# EAGLE design FieldsCore (EAGLE 9.6.2)
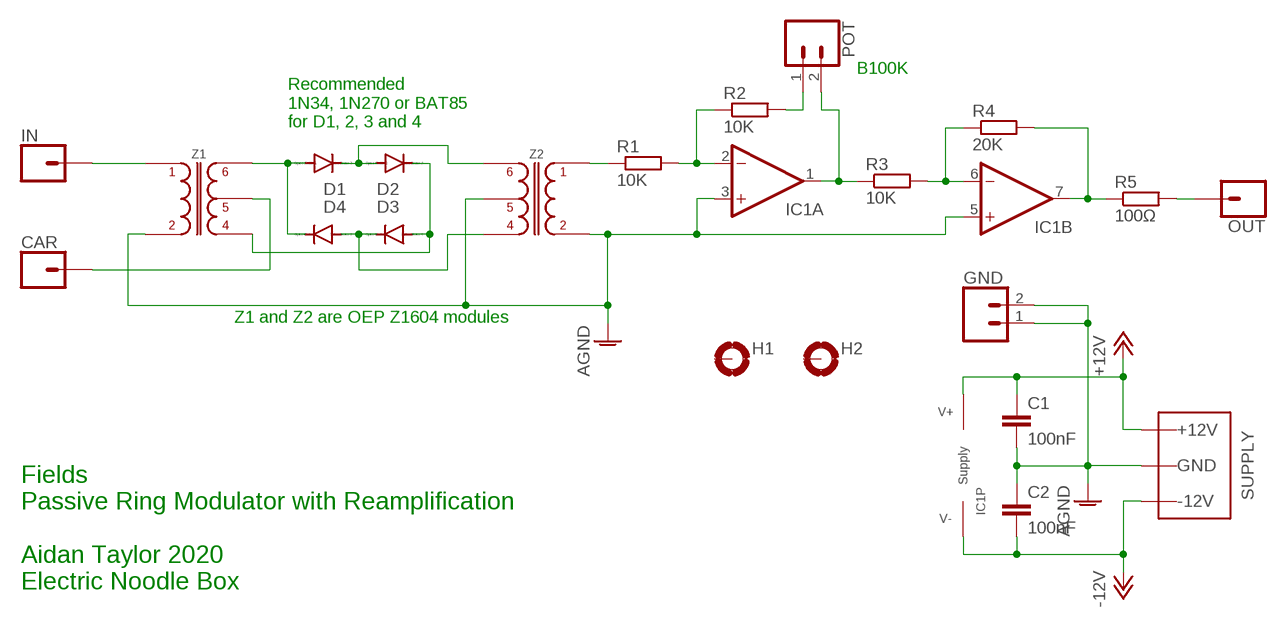
[diagram p0: schematic, sheet 1]

## Parts
C1  100nF  C-EU050-025X075  [C050-025X075]
C2  100nF  C-EU050-025X075  [C050-025X075]
CAR  1XWIREPAD  [1X01]
D1  DIODE-DO35-10  [DO35-10]
D2  DIODE-DO35-10  [DO35-10]
D3  DIODE-DO35-10  [DO35-10]
D4  DIODE-DO35-10  [DO35-10]
GND  2XWIREPAD  [1X02]
H1  MOUNT-PAD-ROUND3.2  [3,2-PAD]
H2  MOUNT-PAD-ROUND3.2  [3,2-PAD]
IC1  TL0X2DIL  [DIL08]
IN  1XWIREPAD  [1X01]
OUT  1XWIREPAD  [1X01]
POT  2XWIREPAD  [1X02]
R1  10K  R-EU_0207/10  [0207/10]
R2  10K  R-EU_0207/10  [0207/10]
R3  10K  R-EU_0207/10  [0207/10]
R4  20K  R-EU_0207/10  [0207/10]
R5  100Ω  R-EU_0207/10  [0207/10]
WP1  COMBO_SUPPLY_HEADER  [COMBINED_POWER]
Z1  Z1604_AUDIO_TRANSFORMER  [Z1604_TRANSFORMER]
Z2  Z1604_AUDIO_TRANSFORMER  [Z1604_TRANSFORMER]

## Nets
+12V: C1.1 IC1.8(P:V+) WP1.V+1(V++) WP1.V+2(V++) WP1.V+3(V++)
-12V: C2.2 IC1.4(P:V-) WP1.V-1(V--) WP1.V-2(V--) WP1.V-3(V--)
AGND: C1.2 C2.1 GND.1 GND.2 IC1.3(A:+IN) IC1.5(B:+IN) WP1.GND1(AGND) WP1.GND2(AGND) WP1.GND3(AGND) WP1.GND4(AGND) WP1.GND5(AGND) WP1.GND6(AGND) WP1.GND7(AGND) WP1.GND8(AGND) Z1.T3 Z2.T3 Z2.T5
N$1: D1.A D4.C Z1.T6
N$2: D1.C D2.A Z2.T6
N$3: D2.C D3.A Z1.T4
N$4: D3.C D4.A Z2.T4
N$5: CAR.1 Z1.T5
N$6: R1.1 Z2.T1
N$7: IC1.2(A:-IN) R1.2 R2.1
N$8: IN.1 Z1.T1
N$10: POT.1 R2.2
N$11: IC1.1(A:OUT) POT.2 R3.1
N$12: IC1.6(B:-IN) R3.2 R4.1
N$13: IC1.7(B:OUT) R4.2 R5.1
N$14: OUT.1 R5.2
Unconnected: H1.B3,2(MOUNT) H2.B3,2(MOUNT)

## Notes on the sheet
- B100K
- Recommended 
  1N34, 1N270 or BAT85
  for D1, 2, 3 and 4
- Z1 and Z2 are OEP Z1604 modules
- Fields 
  Passive Ring Modulator with Reamplification
  
  Aidan Taylor 2020
  Electric Noodle Box

## Library data of the parts
C1 C2 = rcl:C-EU: CAPACITOR, European symbol; SPICEPREFIX: C
CAR IN OUT = ElectricNoodleBox:1XWIREPAD
D1-D4 = diode:DIODE-: DIODE
GND POT = ElectricNoodleBox:2XWIREPAD
H1 H2 = holes:MOUNT-PAD-ROUND: MOUNTING PAD, round
IC1 = ElectricNoodleBox:TL0X2: Dual Operational Amplifier; CATALOGUE: 1103189; RETAILER: Farnell
R1-R5 = rcl:R-EU_: RESISTOR, European symbol; SPICEPREFIX: R
WP1 = ElectricNoodleBox:COMBO_SUPPLY_HEADER
Z1 Z2 = ElectricNoodleBox:Z1604_AUDIO_TRANSFORMER

## Board
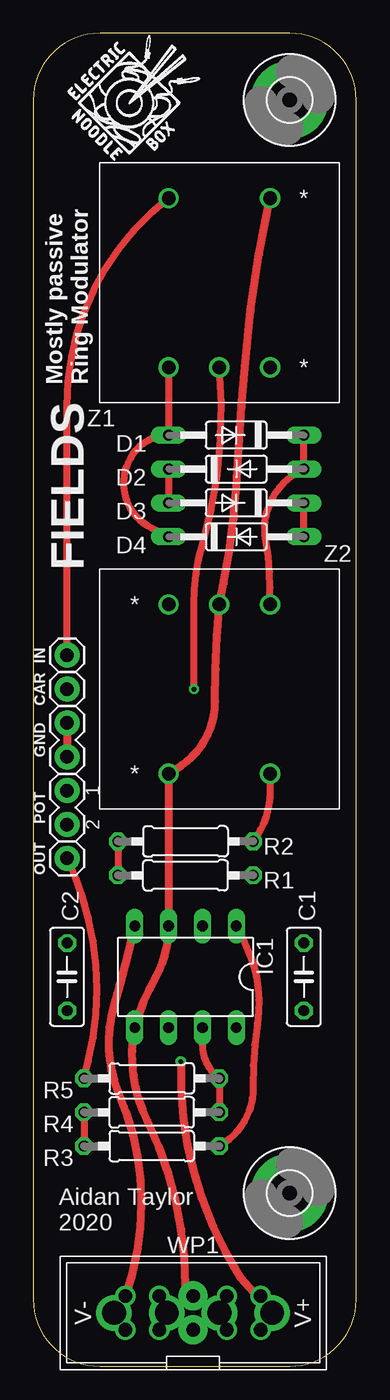
[diagram p1: board, top side]
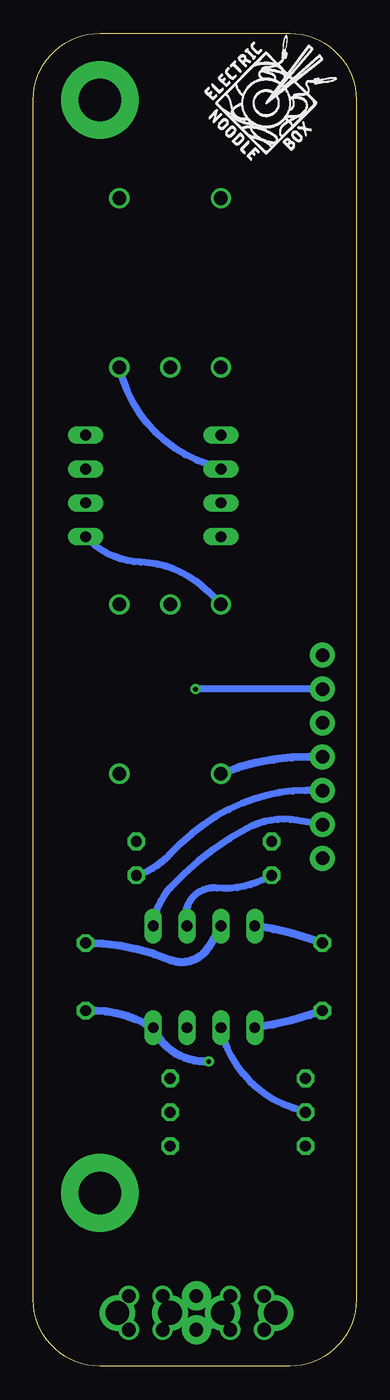
[diagram p2: board, bottom side, seen from below]

Size 24.25 x 100 mm. Coordinates in mm from the lower left corner, seen from the top.
Outline: 24.25,5 24.25,95 arc90 19.25,100 5,100 arc90 0,95 0,5 arc90 5,0 19.25,0 arc90 24.25,5
Copper layers (1*16): Top 0.035mm / dielectric 1.5mm / Bottom 0.035mm
Design rules "default": minimum track width 6mil, minimum drill 0.35mm, track to track 6mil, track to pad 6mil, pad to pad 6mil, via to via 6mil, smd to smd 6mil, copper to edge 40mil, drill to drill 6mil, minimum pad ring 10mil, minimum via ring 8mil, stop-mask expansion 4mil, vias tented up to drill 0mil, thermal gap 10mil

### Footprints (pad centres in the part's own frame; a part is rotated, then mirrored left to right if it is on the bottom)
C050-025X075 = drill 0.813 octagon: 1 -2.54,0; 2 2.54,0
1X01 = drill 1.016 pad 1.88: 1 0,0
DO35-10 = drill 0.813 long: A 5.08,0; C -5.08,0
1X02 = drill 1.016 pad 1.88: 1 0,0; 2 2.54,0
3,2-PAD = drill 3.2 pad 5.842: B3,2 0,0
DIL08 = drill 0.813 long: 1 -3.81,-3.81; 2 -1.27,-3.81; 3 1.27,-3.81; 4 3.81,-3.81; 5 3.81,3.81; 6 1.27,3.81; 7 -1.27,3.81; 8 -3.81,3.81
0207/10 = drill 0.813 octagon: 1 -5.08,0; 2 5.08,0
COMBINED_POWER = drill 1.78: GND1 -1.98,0; GND2 1.98,0; V+1 -5.94,0; V-1 5.94,0 | drill 1.016: GND3 -2.54,1.27; GND5 2.54,1.27; GND6 -2.54,-1.27; GND8 2.54,-1.27; V+2 -5.08,1.27; V+3 -5.08,-1.27; V-2 5.08,1.27; V-3 5.08,-1.27 | drill 1.016 pad 2.184: GND4 0,1.27; GND7 0,-1.27
Z1604_TRANSFORMER = drill 1.016: T1 -3.81,6.35; T3 3.81,6.35; T4 3.81,-6.35; T5 0,-6.35; T6 -3.81,-6.35

### Placement (x,y rotation side)
C1  20.32,29.21 90 top
C2  2.54,29.21 90 top
CAR  2.54,50.8 0 top
D1  15.24,69.85 180 top
D2  15.24,67.31 0 top
D3  15.24,64.77 180 top
D4  15.24,62.23 0 top
GND  2.54,45.72 90 top
H1  19.25,13 0 top
H2  19.25,95 0 top
IC1  11.43,29.21 180 top
IN  2.54,53.34 0 top
OUT  2.54,38.1 0 top
POT  2.54,43.18 270 top
R1  11.43,39.37 180 top
R2  11.43,36.83 0 top
R3  8.89,16.51 180 top
R4  8.89,19.05 0 top
R5  8.89,21.59 180 top
U$1  [LOGO10X10]  2.54,90.17 0 top
U$2  [LOGO10X10]  11.43,90.17 0 bottom
WP1  12,4 180 top
Z1  13.97,81.28 0 top
Z2  13.97,50.8 180 top

### Tracks (layer width: path | path; a pad name or v marks a point on that pad's centre or on a via)
+12V  (via drill 0.35)
  Top 0.61: WP1.V+1 15.56,6.67 arc-17 12.06,14.61 arc-17 11.11,22.86 arc197 v11.08,22.86
  Bottom 0.508: WP1.V+3 WP1.V+1 WP1.V+2
  Bottom 0.61: v11.08,22.86 11.43,22.86 arc66 IC1.8 15.88,25.72 arc-29 C1.1
-12V
  Top 0.61: IC1.4 7.3,31.75 arc-2 6.03,26.99 arc37 6.35,20.64 arc-43 WP1.V-3
  Bottom 0.508: WP1.V-2 WP1.V-1 WP1.V-3
  Bottom 0.61: C2.2 3.49,32.07 arc-11 IC1.4
AGND
  Top 0.61: GND.2 GND.1 | Z1.T3 arc8 15.88,74.93 arc1 15.24,66.04 arc-8 14.29,58.74 Z2.T5 arc5 13.65,49.85 arc-56 11.11,45.09 Z2.T3 IC1.3 arc-31 9.21,29.21 arc11 7.94,26.35 IC1.5 arc36 8.57,18.41 arc-26 11.43,6.03 WP1.GND7 | WP1.GND2 WP1.GND8
  Bottom 0.508: WP1.GND5 WP1.GND2 WP1.GND7 WP1.GND1 | WP1.GND1 WP1.GND4 9.35,3.57 | WP1.GND1 WP1.GND3 | WP1.GND1 WP1.GND6
  Bottom 0.61: GND.1 3.49,45.72 arc-22 Z2.T3 | IC1.3 11.11,31.43 arc81 13.97,30.48 arc-22 C1.2 | C2.1 3.49,26.35 arc11 IC1.5
N$1
  Top 0.508: D4.C 8.89,62.87 arc-115 8.26,69.22 arc-39 D1.A Z1.T6
N$2
  Top 0.508: Z2.T6 17.78,58.42 arc10 17.46,61.91 arc-77 D2.A D1.C
N$3
  Top 0.508: D2.C D3.A
  Bottom 0.508: D2.C 11.11,67.63 arc58 Z1.T4
N$4
  Top 0.508: D4.A D3.C
  Bottom 0.508: Z2.T4 11.11,58.1 arc-43 16.19,60.33 arc45 D4.A
N$5  (via drill 0.35)
  Top 0.508: v12.06,50.8 12.06,57.15 arc-16 12.7,61.59 arc22 Z1.T5
  Bottom 0.508: CAR.1 v12.06,50.8
N$6
  Top 0.508: Z2.T1 17.78,43.18 arc-37 R1.1
N$7
  Top 0.508: R1.2 R2.1
  Bottom 0.508: R2.1 6.99,36.51 arc33 10.48,35.88 arc-116 IC1.2
N$8
  Top 0.508: Z1.T1 arc52 2.54,72.07 IN.1
N$10
  Bottom 0.508: POT.1 3.81,43.18 arc-23 8.57,42.23 arc-25 13.97,38.42 arc32 R2.2
N$11
  Top 0.508: IC1.1 15.88,31.75 arc-35 16.83,25.72 arc10 16.51,20.95 arc-61 R3.1
  Bottom 0.508: POT.2 4.45,40.96 arc-38 8.26,40.32 arc-19 13.97,35.88 arc-37 IC1.1
N$12
  Top 0.508: R4.1 R3.2
  Bottom 0.508: R4.1 4.76,19.37 arc59 IC1.6
N$13
  Top 0.508: R4.2 R5.1 arc-53 12.7,24.13 IC1.7
N$14
  Top 0.508: R5.2 4.13,22.86 arc28 4.13,33.66 arc11 OUT.1

### Text on the board
tPlace: Mostly passive / Ring Modulator | FIELDS | 1 | 2 | Aidan Taylor / 2020